# EAGLE design Arduino MEGA Accordion (EAGLE 5.10)
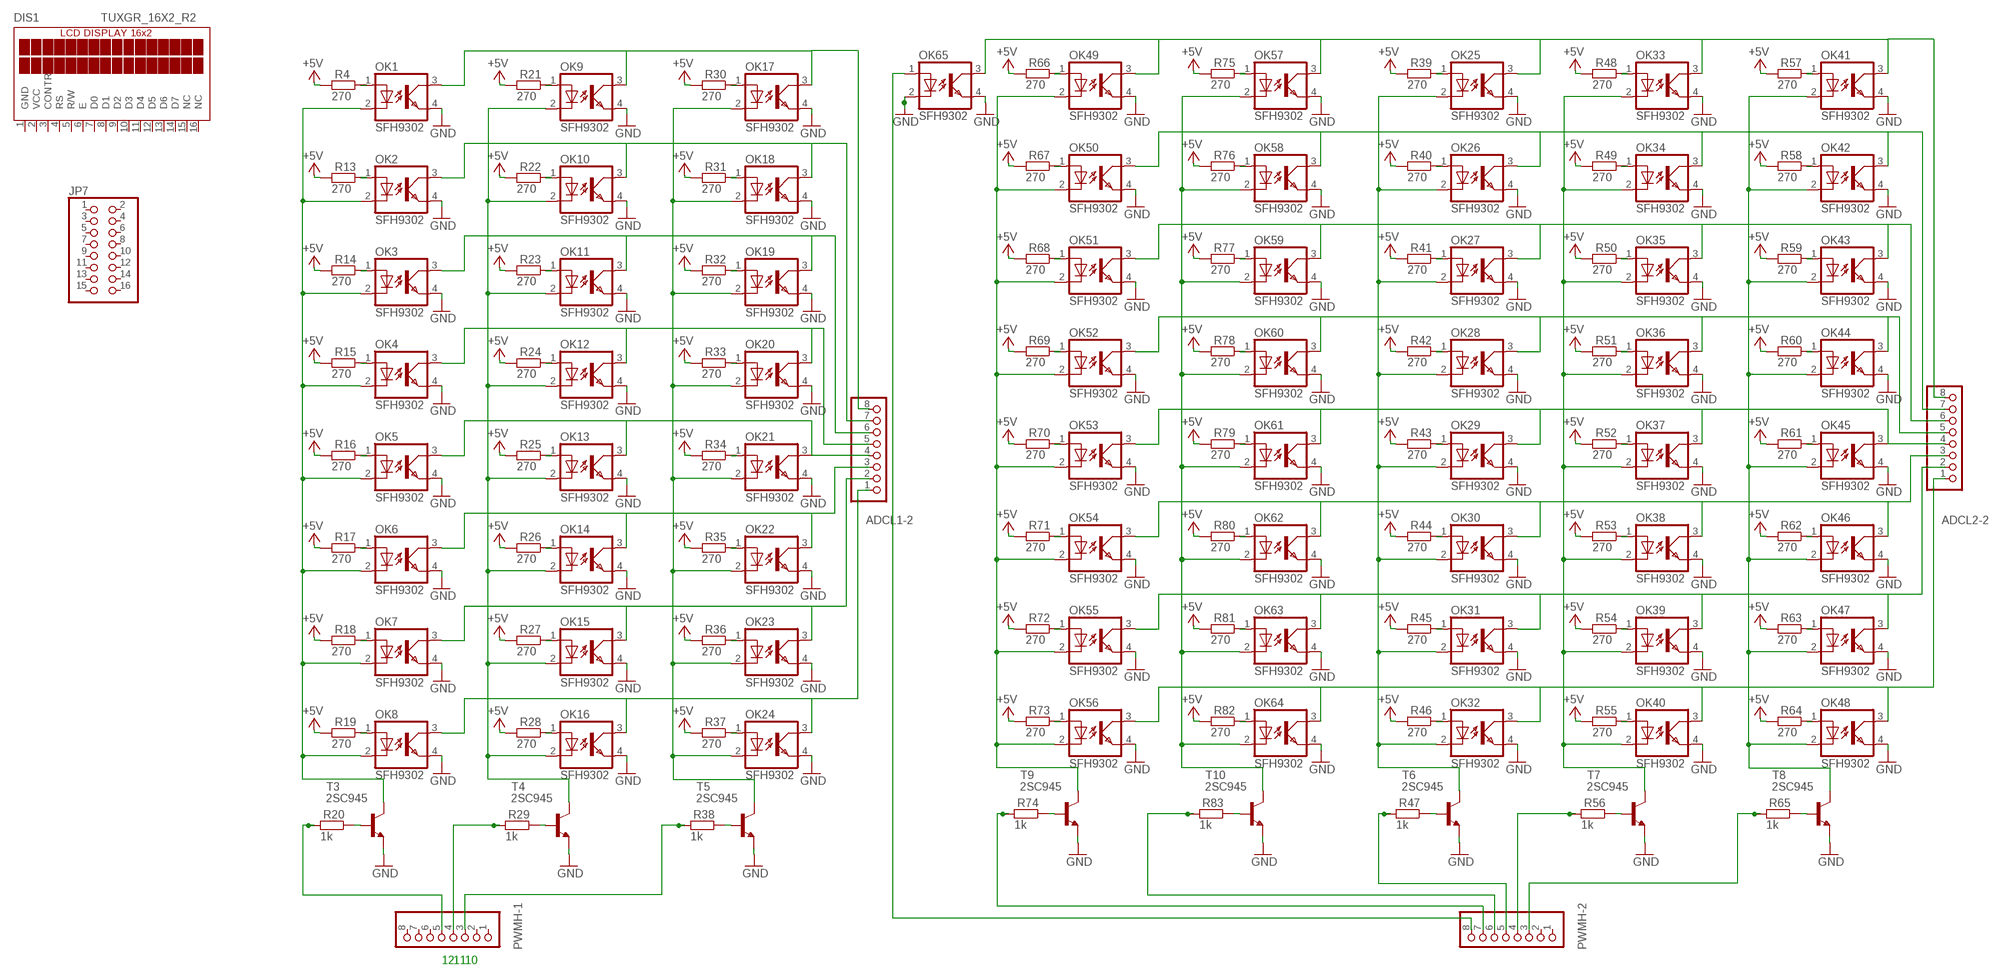
[diagram p0: schematic, sheet 1]

## Parts
ADCL1-2  PINHD-1X8  [1X08]
ADCL2-2  PINHD-1X8  [1X08]
DIS1  TUXGR_16X2_R2  [TUXGR_16X2_R2]
JP7  PINHD-2X8  [2X08]
OK1  SFH9302  [SFH9302]
OK2  SFH9302  [SFH9302]
OK3  SFH9302  [SFH9302]
OK4  SFH9302  [SFH9302]
OK5  SFH9302  [SFH9302]
OK6  SFH9302  [SFH9302]
OK7  SFH9302  [SFH9302]
OK8  SFH9302  [SFH9302]
OK9  SFH9302  [SFH9302]
OK10  SFH9302  [SFH9302]
OK11  SFH9302  [SFH9302]
OK12  SFH9302  [SFH9302]
OK13  SFH9302  [SFH9302]
OK14  SFH9302  [SFH9302]
OK15  SFH9302  [SFH9302]
OK16  SFH9302  [SFH9302]
OK17  SFH9302  [SFH9302]
OK18  SFH9302  [SFH9302]
OK19  SFH9302  [SFH9302]
OK20  SFH9302  [SFH9302]
OK21  SFH9302  [SFH9302]
OK22  SFH9302  [SFH9302]
OK23  SFH9302  [SFH9302]
OK24  SFH9302  [SFH9302]
OK25  SFH9302  [SFH9302]
OK26  SFH9302  [SFH9302]
OK27  SFH9302  [SFH9302]
OK28  SFH9302  [SFH9302]
OK29  SFH9302  [SFH9302]
OK30  SFH9302  [SFH9302]
OK31  SFH9302  [SFH9302]
OK32  SFH9302  [SFH9302]
OK33  SFH9302  [SFH9302]
OK34  SFH9302  [SFH9302]
OK35  SFH9302  [SFH9302]
OK36  SFH9302  [SFH9302]
OK37  SFH9302  [SFH9302]
OK38  SFH9302  [SFH9302]
OK39  SFH9302  [SFH9302]
OK40  SFH9302  [SFH9302]
OK41  SFH9302  [SFH9302]
OK42  SFH9302  [SFH9302]
OK43  SFH9302  [SFH9302]
OK44  SFH9302  [SFH9302]
OK45  SFH9302  [SFH9302]
OK46  SFH9302  [SFH9302]
OK47  SFH9302  [SFH9302]
OK48  SFH9302  [SFH9302]
OK49  SFH9302  [SFH9302]
OK50  SFH9302  [SFH9302]
OK51  SFH9302  [SFH9302]
OK52  SFH9302  [SFH9302]
OK53  SFH9302  [SFH9302]
OK54  SFH9302  [SFH9302]
OK55  SFH9302  [SFH9302]
OK56  SFH9302  [SFH9302]
OK57  SFH9302  [SFH9302]
OK58  SFH9302  [SFH9302]
OK59  SFH9302  [SFH9302]
OK60  SFH9302  [SFH9302]
OK61  SFH9302  [SFH9302]
OK62  SFH9302  [SFH9302]
OK63  SFH9302  [SFH9302]
OK64  SFH9302  [SFH9302]
OK65  SFH9302  [SFH9302]
PWMH-1  PINHD-1X8  [1X08]
PWMH-2  PINHD-1X8  [1X08]
R4  270  R-EU_  [R0805RND]
R13  270  R-EU_  [R0805RND]
R14  270  R-EU_  [R0805RND]
R15  270  R-EU_  [R0805RND]
R16  270  R-EU_  [R0805RND]
R17  270  R-EU_  [R0805RND]
R18  270  R-EU_  [R0805RND]
R19  270  R-EU_  [R0805RND]
R20  1k  R-EU_  [R0805RND]
R21  270  R-EU_  [R0805RND]
R22  270  R-EU_  [R0805RND]
R23  270  R-EU_  [R0805RND]
R24  270  R-EU_  [R0805RND]
R25  270  R-EU_  [R0805RND]
R26  270  R-EU_  [R0805RND]
R27  270  R-EU_  [R0805RND]
R28  270  R-EU_  [R0805RND]
R29  1k  R-EU_  [R0805RND]
R30  270  R-EU_  [R0805RND]
R31  270  R-EU_  [R0805RND]
R32  270  R-EU_  [R0805RND]
R33  270  R-EU_  [R0805RND]
R34  270  R-EU_  [R0805RND]
R35  270  R-EU_  [R0805RND]
R36  270  R-EU_  [R0805RND]
R37  270  R-EU_  [R0805RND]
R38  1k  R-EU_  [R0805RND]
R39  270  R-EU_  [R0805RND]
R40  270  R-EU_  [R0805RND]
R41  270  R-EU_  [R0805RND]
R42  270  R-EU_  [R0805RND]
R43  270  R-EU_  [R0805RND]
R44  270  R-EU_  [R0805RND]
R45  270  R-EU_  [R0805RND]
R46  270  R-EU_  [R0805RND]
R47  1k  R-EU_  [R0805RND]
R48  270  R-EU_  [R0805RND]
R49  270  R-EU_  [R0805RND]
R50  270  R-EU_  [R0805RND]
R51  270  R-EU_  [R0805RND]
R52  270  R-EU_  [R0805RND]
R53  270  R-EU_  [R0805RND]
R54  270  R-EU_  [R0805RND]
R55  270  R-EU_  [R0805RND]
R56  1k  R-EU_  [R0805RND]
R57  270  R-EU_  [R0805RND]
R58  270  R-EU_  [R0805RND]
R59  270  R-EU_  [R0805RND]
R60  270  R-EU_  [R0805RND]
R61  270  R-EU_  [R0805RND]
R62  270  R-EU_  [R0805RND]
R63  270  R-EU_  [R0805RND]
R64  270  R-EU_  [R0805RND]
R65  1k  R-EU_  [R0805RND]
R66  270  R-EU_  [R0805RND]
R67  270  R-EU_  [R0805RND]
R68  270  R-EU_  [R0805RND]
R69  270  R-EU_  [R0805RND]
R70  270  R-EU_  [R0805RND]
R71  270  R-EU_  [R0805RND]
R72  270  R-EU_  [R0805RND]
R73  270  R-EU_  [R0805RND]
R74  1k  R-EU_  [R0805RND]
R75  270  R-EU_  [R0805RND]
R76  270  R-EU_  [R0805RND]
R77  270  R-EU_  [R0805RND]
R78  270  R-EU_  [R0805RND]
R79  270  R-EU_  [R0805RND]
R80  270  R-EU_  [R0805RND]
R81  270  R-EU_  [R0805RND]
R82  270  R-EU_  [R0805RND]
R83  1k  R-EU_  [R0805RND]
T3  2SC945  [TO92-ECB]
T4  2SC945  [TO92-ECB]
T5  2SC945  [TO92-ECB]
T6  2SC945  [TO92-ECB]
T7  2SC945  [TO92-ECB]
T8  2SC945  [TO92-ECB]
T9  2SC945  [TO92-ECB]
T10  2SC945  [TO92-ECB]

## Nets
+5V [usbvcc]: R4.2 R13.2 R14.2 R15.2 R16.2 R17.2 R18.2 R19.2 R21.2 R22.2 R23.2 R24.2 R25.2 R26.2 R27.2 R28.2 R30.2 R31.2 R32.2 R33.2 R34.2 R35.2 R36.2 R37.2 R39.2 R40.2 R41.2 R42.2 R43.2 R44.2 R45.2 R46.2 R48.2 R49.2 R50.2 R51.2 R52.2 R53.2 R54.2 R55.2 R57.2 R58.2 R59.2 R60.2 R61.2 R62.2 R63.2 R64.2 R66.2 R67.2 R68.2 R69.2 R70.2 R71.2 R72.2 R73.2 R75.2 R76.2 R77.2 R78.2 R79.2 R80.2 R81.2 R82.2
GND [gnd]: OK1.4(EMIT) OK2.4(EMIT) OK3.4(EMIT) OK4.4(EMIT) OK5.4(EMIT) OK6.4(EMIT) OK7.4(EMIT) OK8.4(EMIT) OK9.4(EMIT) OK10.4(EMIT) OK11.4(EMIT) OK12.4(EMIT) OK13.4(EMIT) OK14.4(EMIT) OK15.4(EMIT) OK16.4(EMIT) OK17.4(EMIT) OK18.4(EMIT) OK19.4(EMIT) OK20.4(EMIT) OK21.4(EMIT) OK22.4(EMIT) OK23.4(EMIT) OK24.4(EMIT) OK25.4(EMIT) OK26.4(EMIT) OK27.4(EMIT) OK28.4(EMIT) OK29.4(EMIT) OK30.4(EMIT) OK31.4(EMIT) OK32.4(EMIT) OK33.4(EMIT) OK34.4(EMIT) OK35.4(EMIT) OK36.4(EMIT) OK37.4(EMIT) OK38.4(EMIT) OK39.4(EMIT) OK40.4(EMIT) OK41.4(EMIT) OK42.4(EMIT) OK43.4(EMIT) OK44.4(EMIT) OK45.4(EMIT) OK46.4(EMIT) OK47.4(EMIT) OK48.4(EMIT) OK49.4(EMIT) OK50.4(EMIT) OK51.4(EMIT) OK52.4(EMIT) OK53.4(EMIT) OK54.4(EMIT) OK55.4(EMIT) OK56.4(EMIT) OK57.4(EMIT) OK58.4(EMIT) OK59.4(EMIT) OK60.4(EMIT) OK61.4(EMIT) OK62.4(EMIT) OK63.4(EMIT) OK64.4(EMIT) OK65.2(C) OK65.4(EMIT) T3.E T4.E T5.E T6.E T7.E T8.E T9.E T10.E
N$1: OK1.1(A) R4.1
N$5: R20.2
N$8: R29.2
N$9: OK2.1(A) R13.1
N$10: OK3.1(A) R14.1
N$11: OK4.1(A) R15.1
N$12: OK5.1(A) R16.1
N$13: OK6.1(A) R17.1
N$14: OK7.1(A) R18.1
N$16: OK8.1(A) R19.1
N$17: R20.1 T3.B
N$18: R38.2
N$19: OK1.2(C) OK2.2(C) OK3.2(C) OK4.2(C) OK5.2(C) OK6.2(C) OK7.2(C) OK8.2(C) T3.C
N$20: OK17.2(C) OK18.2(C) OK19.2(C) OK20.2(C) OK21.2(C) OK22.2(C) OK23.2(C) OK24.2(C) T5.C
N$21: OK1.3(COL) OK9.3(COL) OK17.3(COL)
N$22: OK25.1(A) R39.1
N$23: OK2.3(COL) OK10.3(COL) OK18.3(COL)
N$24: OK26.1(A) R40.1
N$25: OK3.3(COL) OK11.3(COL) OK19.3(COL)
N$26: OK4.3(COL) OK12.3(COL) OK20.3(COL)
N$27: OK9.1(A) R21.1
N$28: OK10.1(A) R22.1
N$29: OK11.1(A) R23.1
N$30: OK12.1(A) R24.1
N$31: OK13.1(A) R25.1
N$32: OK14.1(A) R26.1
N$33: OK15.1(A) R27.1
N$34: OK16.1(A) R28.1
N$35: R29.1 T4.B
N$36: OK9.2(C) OK10.2(C) OK11.2(C) OK12.2(C) OK13.2(C) OK14.2(C) OK15.2(C) OK16.2(C) T4.C
N$37: OK17.1(A) R30.1
N$38: OK18.1(A) R31.1
N$39: OK19.1(A) R32.1
N$40: OK20.1(A) R33.1
N$41: OK21.1(A) R34.1
N$42: OK22.1(A) R35.1
N$43: OK23.1(A) R36.1
N$44: OK24.1(A) R37.1
N$45: R38.1 T5.B
N$46: OK5.3(COL) OK13.3(COL) OK21.3(COL)
N$47: OK6.3(COL) OK14.3(COL) OK22.3(COL)
N$48: OK7.3(COL) OK15.3(COL) OK23.3(COL)
N$49: OK8.3(COL) OK16.3(COL) OK24.3(COL)
N$50: OK27.1(A) R41.1
N$51: OK28.1(A) R42.1
N$52: OK29.1(A) R43.1
N$56: OK30.1(A) R44.1
N$57: OK31.1(A) R45.1
N$58: OK32.1(A) R46.1
N$59: R47.1 T6.B
N$61: OK25.2(C) OK26.2(C) OK27.2(C) OK28.2(C) OK29.2(C) OK30.2(C) OK31.2(C) OK32.2(C) T6.C
N$62: OK33.1(A) R48.1
N$63: OK34.1(A) R49.1
N$64: OK35.1(A) R50.1
N$65: OK36.1(A) R51.1
N$66: OK37.1(A) R52.1
N$67: OK38.1(A) R53.1
N$68: OK39.1(A) R54.1
N$69: OK40.1(A) R55.1
N$70: R56.1 T7.B
N$71: OK33.2(C) OK34.2(C) OK35.2(C) OK36.2(C) OK37.2(C) OK38.2(C) OK39.2(C) OK40.2(C) T7.C
N$72: OK41.1(A) R57.1
N$73: OK42.1(A) R58.1
N$74: OK43.1(A) R59.1
N$75: OK44.1(A) R60.1
N$76: OK45.1(A) R61.1
N$77: OK46.1(A) R62.1
N$78: OK47.1(A) R63.1
N$79: OK48.1(A) R64.1
N$80: R65.1 T8.B
N$81: OK41.2(C) OK42.2(C) OK43.2(C) OK44.2(C) OK45.2(C) OK46.2(C) OK47.2(C) OK48.2(C) T8.C
N$82: OK26.3(COL) OK34.3(COL) OK42.3(COL) OK50.3(COL) OK58.3(COL)
N$83: OK27.3(COL) OK35.3(COL) OK43.3(COL) OK51.3(COL) OK59.3(COL)
N$84: OK28.3(COL) OK36.3(COL) OK44.3(COL) OK52.3(COL) OK60.3(COL)
N$85: OK29.3(COL) OK37.3(COL) OK45.3(COL) OK53.3(COL) OK61.3(COL)
N$86: OK30.3(COL) OK38.3(COL) OK46.3(COL) OK54.3(COL) OK62.3(COL)
N$87: OK31.3(COL) OK39.3(COL) OK47.3(COL) OK55.3(COL) OK63.3(COL)
N$88: OK32.3(COL) OK40.3(COL) OK48.3(COL) OK56.3(COL) OK64.3(COL)
N$89: OK25.3(COL) OK33.3(COL) OK41.3(COL) OK49.3(COL) OK57.3(COL) OK65.3(COL)
N$90: R47.2
N$91: R56.2
N$92: R65.2
N$93: OK49.1(A) R66.1
N$94: OK50.1(A) R67.1
N$95: OK51.1(A) R68.1
N$96: OK52.1(A) R69.1
N$97: OK53.1(A) R70.1
N$98: OK54.1(A) R71.1
N$99: OK55.1(A) R72.1
N$100: OK56.1(A) R73.1
N$101: R74.1 T9.B
N$102: OK49.2(C) OK50.2(C) OK51.2(C) OK52.2(C) OK53.2(C) OK54.2(C) OK55.2(C) OK56.2(C) T9.C
N$103: OK57.1(A) R75.1
N$104: OK58.1(A) R76.1
N$105: OK59.1(A) R77.1
N$106: OK60.1(A) R78.1
N$107: OK61.1(A) R79.1
N$108: OK62.1(A) R80.1
N$109: OK63.1(A) R81.1
N$110: OK64.1(A) R82.1
N$111: R83.1 T10.B
N$112: OK57.2(C) OK58.2(C) OK59.2(C) OK60.2(C) OK61.2(C) OK62.2(C) OK63.2(C) OK64.2(C) T10.C
N$115: OK65.1(A)
N$121: R74.2
N$122: R83.2
Unconnected: ADCL1-2.1 ADCL1-2.2 ADCL1-2.3 ADCL1-2.4 ADCL1-2.5 ADCL1-2.6 ADCL1-2.7 ADCL1-2.8 ADCL2-2.1 ADCL2-2.2 ADCL2-2.3 ADCL2-2.4 ADCL2-2.5 ADCL2-2.6 ADCL2-2.7 ADCL2-2.8 DIS1.3(CONTR) DIS1.4(RS) DIS1.5(R/W) DIS1.6(E) DIS1.7(D0) DIS1.8(D1) DIS1.9(D2) DIS1.10(D3) DIS1.11(D4) DIS1.12(D5) DIS1.13(D6) DIS1.14(D7) DIS1.15(NC) DIS1.16(NC) JP7.1 JP7.2 JP7.3 JP7.4 JP7.5 JP7.6 JP7.7 JP7.8 JP7.9 JP7.10 JP7.11 JP7.12 JP7.13 JP7.14 JP7.15 JP7.16 PWMH-1.1 PWMH-1.2 PWMH-1.3 PWMH-1.4 PWMH-1.5 PWMH-1.6 PWMH-1.7 PWMH-1.8 PWMH-2.1 PWMH-2.2 PWMH-2.3 PWMH-2.4 PWMH-2.5 PWMH-2.6 PWMH-2.7 PWMH-2.8

## Notes on the sheet
- 12 | 11 | 10

## Power pins joined to a net without a drawn wire
GND: DIS1.1(GND)
VCC: DIS1.2(VCC)

## Library data of the parts
ADCL1-2 ADCL2-2 PWMH-1 PWMH-2 = pinhead:PINHD-1X8: PIN HEADER
DIS1 = display-lcd:TUXGR_16X2_R2: Tuxgraphics LCD display 16x2 characters reflective, without background light Source: tuxgr_12x2_r2.pdf
JP7 = pinhead:PINHD-2X8: PIN HEADER
OK1-OK65 = optocoupler:SFH9*: Slotted Interrupter / Gabellichtschranke Source: http://www.osram.convergy.de/
R4 R13-R83 = rcl:R-EU_: RESISTOR, European symbol
T3-T10 = transistor:2SC945: NPN Silicon Epitaxial Planar Transistor Source: SEMTECH ELECTRONICS LTD. ... 2SC945 2.pdf

## Net classes
0 default: width 0.203 mm, drill 0.406 mm, clearance 0.203 mm
1 power: width 0.61 mm, drill 0.711 mm, clearance 0.203 mm
2 gnd: width 0.305 mm, drill 0.711 mm, clearance 0.203 mm
3 usbvcc: width 0.508 mm, drill 0.711 mm, clearance 0.203 mm

## Board
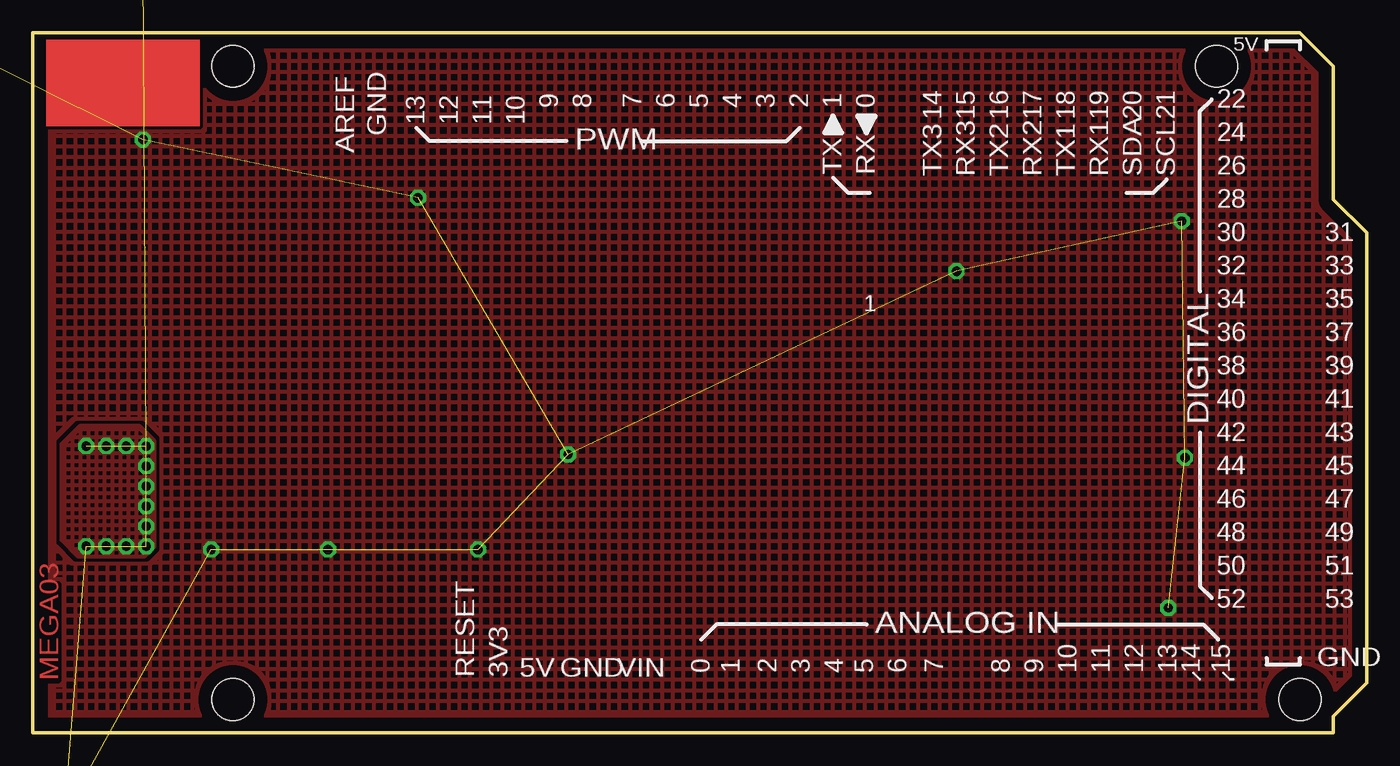
[diagram p1: board, top side]
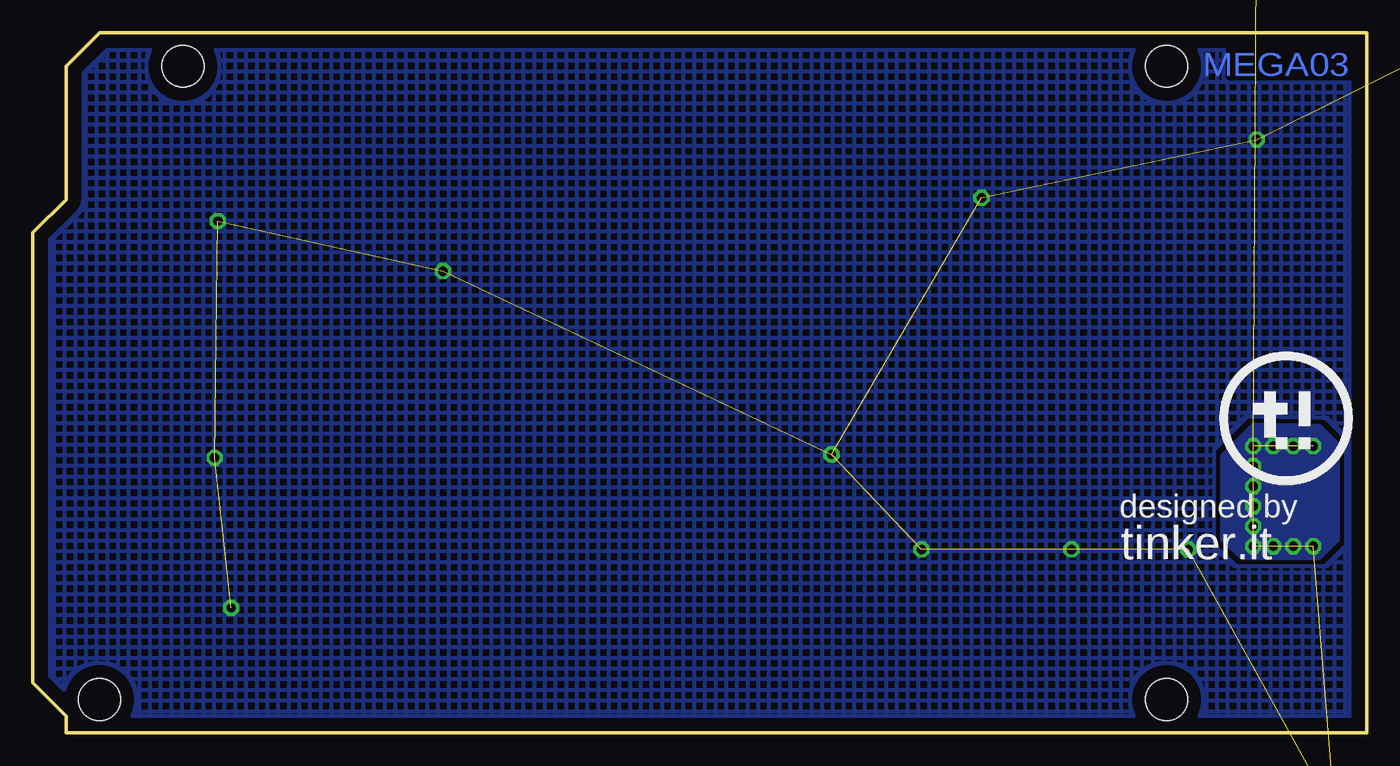
[diagram p2: board, bottom side, seen from below]

Size 101.6 x 53.34 mm. Coordinates in mm from the lower left corner, seen from the top.
Outline: 0,53.34 96.52,53.34 99.06,50.8 99.06,40.64 101.6,38.1 101.6,3.81 99.06,1.27 99.06,0 0,0 0,53.34
Copper layers (1*16): Top 0.035mm / dielectric 1.5mm / Bottom 0.035mm
Design rules "default *": minimum track width 8mil, minimum drill 16mil, track to track 8mil, track to pad 8mil, pad to pad 8mil, via to via 10mil, smd to smd 8mil, copper to edge 40mil, drill to drill 12mil, minimum pad ring 10mil, minimum via ring 10mil, stop-mask expansion 4mil, vias tented up to drill 0mil, thermal gap 10mil
Holes 3.2 mm at 96.52,2.54 15.24,50.8 90.17,50.8 15.24,2.54

### Footprints (pad centres in the part's own frame; a part is rotated, then mirrored left to right if it is on the bottom)
1X08 = drill 1.016 long: 1 -8.89,0; 2 -6.35,0; 3 -3.81,0; 4 -1.27,0; 5 1.27,0; 6 3.81,0; 7 6.35,0; 8 8.89,0
TUXGR_16X2_R2 = drill 1 pad 1.676 round: 1 -32,15.5; 2 -29.46,15.5; 3 -26.92,15.5; 4 -24.38,15.5; 5 -21.84,15.5; 6 -19.3,15.5; 7 -16.76,15.5; 8 -14.22,15.5; 9 -11.68,15.5; 10 -9.14,15.5; 11 -6.6,15.5; 12 -4.06,15.5; 13 -1.52,15.5; 14 1.02,15.5; 15 3.56,15.5; 16 6.1,15.5 | hole 2.5: -37.5,-15.5; 37.5,-15.5; -37.5,15.5; 37.5,15.5
2X08 = drill 1.016 octagon: 1 -8.89,-1.27; 2 -8.89,1.27; 3 -6.35,-1.27; 4 -6.35,1.27; 5 -3.81,-1.27; 6 -3.81,1.27; 7 -1.27,-1.27; 8 -1.27,1.27; 9 1.27,-1.27; 10 1.27,1.27; 11 3.81,-1.27; 12 3.81,1.27; 13 6.35,-1.27; 14 6.35,1.27; 15 8.89,-1.27; 16 8.89,1.27
SFH9302 = drill 1.016 round: 1 -4.05,-1.27; 2 -4.05,1.27; 3 4.05,1.27; 4 4.05,-1.27 | hole 3.3: -9.5,0; 9.5,0
R0805RND = smd 1.3 x 1.5: 1 -0.977,0; 2 0.977,0
TO92-ECB = drill 0.813 long: B 2.54,0; C 0,0; E -2.54,0

### Placement (x,y rotation side)
ADCL1-2  -27.3,-466.73 0 top  (outside the outline)
ADCL2-2  -8.26,228.6 0 top  (outside the outline)
DIS1  32.38,-25.4 0 top  (outside the outline)
JP7  -28.57,-481.33 0 top  (outside the outline)
OK1  5.08,-49.53 0 top  (outside the outline)
OK2  -9.53,-283.85 0 top  (outside the outline)
OK3  -9.53,-300.36 0 top  (outside the outline)
OK4  -9.53,-310.51 0 top  (outside the outline)
OK5  -9.53,-327.02 0 top  (outside the outline)
OK6  -9.53,-337.19 0 top  (outside the outline)
OK7  -9.53,-347.35 0 top  (outside the outline)
OK8  -9.53,-357.5 0 top  (outside the outline)
OK9  -24.77,-374.65 0 top  (outside the outline)
OK10  -24.77,-384.81 0 top  (outside the outline)
OK11  -24.77,-394.97 0 top  (outside the outline)
OK12  -24.77,-405.13 0 top  (outside the outline)
OK13  -24.77,-415.29 0 top  (outside the outline)
OK14  -24.77,-425.45 0 top  (outside the outline)
OK15  -24.77,-435.61 0 top  (outside the outline)
OK16  -24.77,-445.77 0 top  (outside the outline)
OK17  -24.77,60.96 0 top  (outside the outline)
OK18  -24.77,71.12 0 top  (outside the outline)
OK19  -24.77,81.28 0 top  (outside the outline)
OK20  -24.77,91.44 0 top  (outside the outline)
OK21  -24.77,101.6 0 top  (outside the outline)
OK22  -24.77,111.76 0 top  (outside the outline)
OK23  -24.77,121.92 0 top  (outside the outline)
OK24  -24.77,132.08 0 top  (outside the outline)
OK25  -25.4,149.22 0 top  (outside the outline)
OK26  1.27,149.22 0 top  (outside the outline)
OK27  27.94,149.22 0 top  (outside the outline)
OK28  -25.4,159.38 0 top  (outside the outline)
OK29  1.27,159.38 0 top  (outside the outline)
OK30  27.94,159.38 0 top  (outside the outline)
OK31  -25.4,169.54 0 top  (outside the outline)
OK32  1.27,169.54 0 top  (outside the outline)
OK33  27.94,169.54 0 top  (outside the outline)
OK34  -25.4,179.71 0 top  (outside the outline)
OK35  1.27,179.71 0 top  (outside the outline)
OK36  27.94,179.71 0 top  (outside the outline)
OK37  -25.4,189.87 0 top  (outside the outline)
OK38  1.27,189.87 0 top  (outside the outline)
OK39  27.94,189.87 0 top  (outside the outline)
OK40  -25.4,200.03 0 top  (outside the outline)
OK41  1.27,200.03 0 top  (outside the outline)
OK42  27.94,200.03 0 top  (outside the outline)
OK43  -25.4,210.19 0 top  (outside the outline)
OK44  1.27,210.19 0 top  (outside the outline)
OK45  27.94,210.19 0 top  (outside the outline)
OK46  -25.4,220.34 0 top  (outside the outline)
OK47  1.27,220.34 0 top  (outside the outline)
OK48  27.94,220.34 0 top  (outside the outline)
OK49  -25.4,253.37 0 top  (outside the outline)
OK50  1.27,253.37 0 top  (outside the outline)
OK51  -25.4,263.52 0 top  (outside the outline)
OK52  1.27,263.52 0 top  (outside the outline)
OK53  -25.4,273.69 0 top  (outside the outline)
OK54  1.27,273.69 0 top  (outside the outline)
OK55  -25.4,283.85 0 top  (outside the outline)
OK56  1.27,283.85 0 top  (outside the outline)
OK57  -25.4,294 0 top  (outside the outline)
OK58  1.27,294 0 top  (outside the outline)
OK59  -25.4,304.17 0 top  (outside the outline)
OK60  1.27,304.17 0 top  (outside the outline)
OK61  -25.4,314.32 0 top  (outside the outline)
OK62  1.27,314.32 0 top  (outside the outline)
OK63  -25.4,324.49 0 top  (outside the outline)
OK64  1.27,324.49 0 top  (outside the outline)
OK65  -26.04,-474.35 0 top  (outside the outline)
PWMH-1  -26.67,-460.38 0 top  (outside the outline)
PWMH-2  13.97,228.6 0 top  (outside the outline)
R4  -20.32,-274.32 0 top  (outside the outline)
R13  -20.32,-291.46 0 top  (outside the outline)
R14  -20.32,-318.13 0 top  (outside the outline)
R15  -13.97,-318.13 0 top  (outside the outline)
R16  6.35,-354.96 0 top  (outside the outline)
R17  -20.32,-365.12 0 top  (outside the outline)
R18  -13.97,-365.12 0 top  (outside the outline)
R19  -7.62,-365.12 0 top  (outside the outline)
R20  -35.56,-365.12 0 top  (outside the outline)
R21  0.64,-443.23 0 top  (outside the outline)
R22  6.99,-443.23 0 top  (outside the outline)
R23  -35.56,-453.39 0 top  (outside the outline)
R24  -29.21,-453.39 0 top  (outside the outline)
R25  -22.86,-453.39 0 top  (outside the outline)
R26  -16.51,-453.39 0 top  (outside the outline)
R27  -10.16,-453.39 0 top  (outside the outline)
R28  -3.81,-453.39 0 top  (outside the outline)
R29  2.54,-453.39 0 top  (outside the outline)
R30  0.64,131.44 0 top  (outside the outline)
R31  6.99,131.44 0 top  (outside the outline)
R32  -35.56,141.6 0 top  (outside the outline)
R33  -29.21,141.6 0 top  (outside the outline)
R34  -22.86,141.6 0 top  (outside the outline)
R35  -16.51,141.6 0 top  (outside the outline)
R36  -10.16,141.6 0 top  (outside the outline)
R37  -3.81,141.6 0 top  (outside the outline)
R38  2.54,141.6 0 top  (outside the outline)
R39  27.3,229.87 0 top  (outside the outline)
R40  33.66,229.87 0 top  (outside the outline)
R41  40.01,229.87 0 top  (outside the outline)
R42  46.35,229.87 0 top  (outside the outline)
R43  -36.2,238.76 0 top  (outside the outline)
R44  -29.84,238.76 0 top  (outside the outline)
R45  -23.5,238.76 0 top  (outside the outline)
R46  -17.14,238.76 0 top  (outside the outline)
R47  -10.79,238.76 0 top  (outside the outline)
R48  -4.45,238.76 0 top  (outside the outline)
R49  1.91,238.76 0 top  (outside the outline)
R50  8.26,238.76 0 top  (outside the outline)
R51  14.61,238.76 0 top  (outside the outline)
R52  20.95,238.76 0 top  (outside the outline)
R53  27.3,238.76 0 top  (outside the outline)
R54  33.66,238.76 0 top  (outside the outline)
R55  40.01,238.76 0 top  (outside the outline)
R56  46.35,238.76 0 top  (outside the outline)
R57  -36.2,245.75 0 top  (outside the outline)
R58  -29.84,245.75 0 top  (outside the outline)
R59  -23.5,245.75 0 top  (outside the outline)
R60  -17.14,245.75 0 top  (outside the outline)
R61  -10.79,245.75 0 top  (outside the outline)
R62  -4.45,245.75 0 top  (outside the outline)
R63  1.91,245.75 0 top  (outside the outline)
R64  8.26,245.75 0 top  (outside the outline)
R65  14.61,245.75 0 top  (outside the outline)
R66  -13.97,334.01 0 top  (outside the outline)
R67  -7.62,334.01 0 top  (outside the outline)
R68  -1.27,334.01 0 top  (outside the outline)
R69  5.08,334.01 0 top  (outside the outline)
R70  11.43,334.01 0 top  (outside the outline)
R71  17.78,334.01 0 top  (outside the outline)
R72  24.13,334.01 0 top  (outside the outline)
R73  30.48,334.01 0 top  (outside the outline)
R74  -36.2,341 0 top  (outside the outline)
R75  -29.84,341 0 top  (outside the outline)
R76  -23.5,341 0 top  (outside the outline)
R77  -17.14,341 0 top  (outside the outline)
R78  -10.79,341 0 top  (outside the outline)
R79  -4.45,341 0 top  (outside the outline)
R80  1.91,341 0 top  (outside the outline)
R81  8.26,341 0 top  (outside the outline)
R82  14.61,341 0 top  (outside the outline)
R83  20.95,341 0 top  (outside the outline)
T3  -27.94,-364.49 0 top  (outside the outline)
T4  -6.99,-445.13 0 top  (outside the outline)
T5  -6.99,132.08 0 top  (outside the outline)
T6  45.72,220.34 0 top  (outside the outline)
T7  -34.29,230.5 0 top  (outside the outline)
T8  -24.77,230.5 0 top  (outside the outline)
T9  19.05,324.49 0 top  (outside the outline)
T10  28.57,324.49 0 top  (outside the outline)

### Tracks (layer width: path | path; a pad name or v marks a point on that pad's centre or on a via)
+5V  (via drill 0.71)  (75 unrouted)
  other vias: 4.06,21.84 8.64,21.84 7.11,21.84 5.59,21.84 8.64,20.32 8.64,18.8 4.06,14.22 5.59,14.22 7.11,14.22 8.64,15.75 8.64,17.27 8.64,14.22
  pour Top (isolate 0.305, hatched): 8.51,13.46 9.27,14.22 9.27,22.23 8.13,23.37 3.56,23.37 2.16,21.97 2.16,14.73 3.43,13.46
  pour Bottom: 2.16,14.73 2.16,21.97 3.56,23.37 8.64,23.5 11.05,21.08 11.05,14.73 9.53,13.34 3.56,13.34
GND  (via drill 0.71)  (84 unrouted)
  other vias: 29.34,40.77 87.5,38.99 87.76,20.95 70.36,35.18 86.49,9.53 22.48,13.97 13.59,13.97 33.91,13.97 8.38,45.21 40.77,21.21
  pour Top (isolate 0.254, rank 2, hatched): 0.64,52.7 101.6,52.7 101.6,0.64 0.64,0.64
  pour Bottom (isolate 0.305, rank 2, hatched): 0.64,52.7 101.6,52.7 102.23,52.07 102.23,0.64 1.27,0.64 0.64,1.27
N$1  (1 unrouted)
N$9  (1 unrouted)
N$10  (1 unrouted)
N$11  (1 unrouted)
N$12  (1 unrouted)
N$13  (1 unrouted)
N$14  (1 unrouted)
N$16  (1 unrouted)
N$17  (1 unrouted)
N$19  (8 unrouted)
N$20  (8 unrouted)
N$21  (2 unrouted)
N$22  (1 unrouted)
N$23  (2 unrouted)
N$24  (1 unrouted)
N$25  (2 unrouted)
N$26  (2 unrouted)
N$27  (1 unrouted)
N$28  (1 unrouted)
N$29  (1 unrouted)
N$30  (1 unrouted)
N$31  (1 unrouted)
N$32  (1 unrouted)
N$33  (1 unrouted)
N$34  (1 unrouted)
N$35  (1 unrouted)
N$36  (8 unrouted)
N$37  (1 unrouted)
N$38  (1 unrouted)
N$39  (1 unrouted)
N$40  (1 unrouted)
N$41  (1 unrouted)
N$42  (1 unrouted)
N$43  (1 unrouted)
N$44  (1 unrouted)
N$45  (1 unrouted)
N$46  (2 unrouted)
N$47  (2 unrouted)
N$48  (2 unrouted)
N$49  (2 unrouted)
N$50  (1 unrouted)
N$51  (1 unrouted)
N$52  (1 unrouted)
N$56  (1 unrouted)
N$57  (1 unrouted)
N$58  (1 unrouted)
N$59  (1 unrouted)
N$61  (8 unrouted)
N$62  (1 unrouted)
N$63  (1 unrouted)
N$64  (1 unrouted)
N$65  (1 unrouted)
N$66  (1 unrouted)
N$67  (1 unrouted)
N$68  (1 unrouted)
N$69  (1 unrouted)
N$70  (1 unrouted)
N$71  (8 unrouted)
N$72  (1 unrouted)
N$73  (1 unrouted)
N$74  (1 unrouted)
N$75  (1 unrouted)
N$76  (1 unrouted)
N$77  (1 unrouted)
N$78  (1 unrouted)
N$79  (1 unrouted)
N$80  (1 unrouted)
N$81  (8 unrouted)
N$82  (4 unrouted)
N$83  (4 unrouted)
N$84  (4 unrouted)
N$85  (4 unrouted)
N$86  (4 unrouted)
N$87  (4 unrouted)
N$88  (4 unrouted)
N$89  (5 unrouted)
N$93  (1 unrouted)
N$94  (1 unrouted)
N$95  (1 unrouted)
N$96  (1 unrouted)
N$97  (1 unrouted)
N$98  (1 unrouted)
N$99  (1 unrouted)
N$100  (1 unrouted)
N$101  (1 unrouted)
N$102  (8 unrouted)
N$103  (1 unrouted)
N$104  (1 unrouted)
N$105  (1 unrouted)
N$106  (1 unrouted)
N$107  (1 unrouted)
N$108  (1 unrouted)
N$109  (1 unrouted)
N$110  (1 unrouted)
N$111  (1 unrouted)
N$112  (8 unrouted)
(copper drawn outside any net)
  shapes: Top area x1

### Text on the board
Top: MEGA03
Bottom: MEGA03
tPlace: 9 | 8 | 7 | 6 | 5 | 4 | 3 | 2 | 1 | 0 | 22 | 14 | 15 | 16 | 17 | 18 | 19 | 20 | 21 | 13 | 12 | 11 | 10 | 24 | 26 | 28 | 30 | 31 | 32 | 33 | 34 | 35 | 36 | 37 | 38 | 39 | 40 | 41 | 42 | 43 | 44 | 45 | 46 | 47 | 48 | 49 | 50 | 51 | 52 | 53 | 0 | 1 | 2 | 3 | 4 | 5 | 6 | 7 | 8 | 9 | 10 | 11 | 12 | 13 | 14 | 15
tNames: 5V | GND | AREF | PWM | TX | RX | TX3 | RX3 | TX2 | RX2 | TX1 | RX1 | SDA | SCL | 1 | DIGITAL | ANALOG IN | GND | RESET | 3V3 | 5V | GND | VIN
bNames: designed by | tinker.it
Reference: C7 | C6